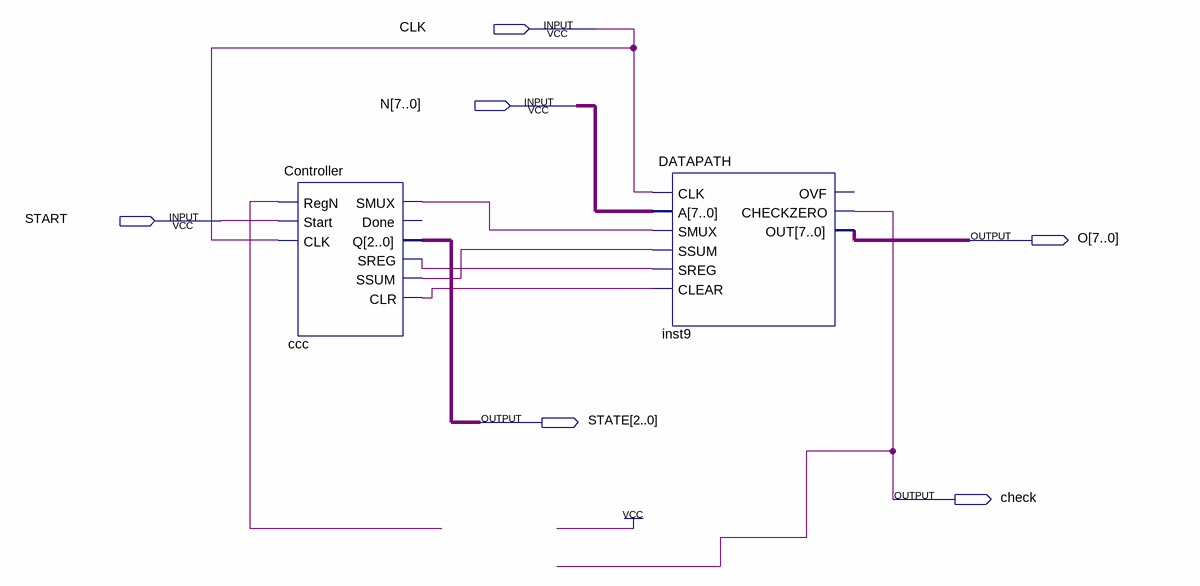
[diagram p0: schematic sheet]
// Quartus schematic Block2.bdf as structural Verilog: 2 symbols, 6 pins
module Block2 (
  input  CLK,
  input  [7:0] N,
  input  START,
  output [7:0] O,
  output [2:0] STATE,
  output check
);

  wire ccc_clr, ccc_smux, ccc_sreg, ccc_ssum, undriven;

  Controller ccc (
    .RegN(undriven), .Start(START), .CLK(CLK), .SMUX(ccc_smux), .Q(STATE), .SREG(ccc_sreg), .SSUM(ccc_ssum),
    .CLR(ccc_clr));  // open: Done
  DATAPATH inst9 (
    .CLK(CLK), .A(N), .SMUX(ccc_smux), .SSUM(ccc_ssum), .SREG(ccc_sreg), .CLEAR(ccc_clr), .CHECKZERO(check),
    .OUT(O));  // open: OVF
endmodule
